# Altium schematic sheet ASBB_SPICrossbar.SchDoc
size A4
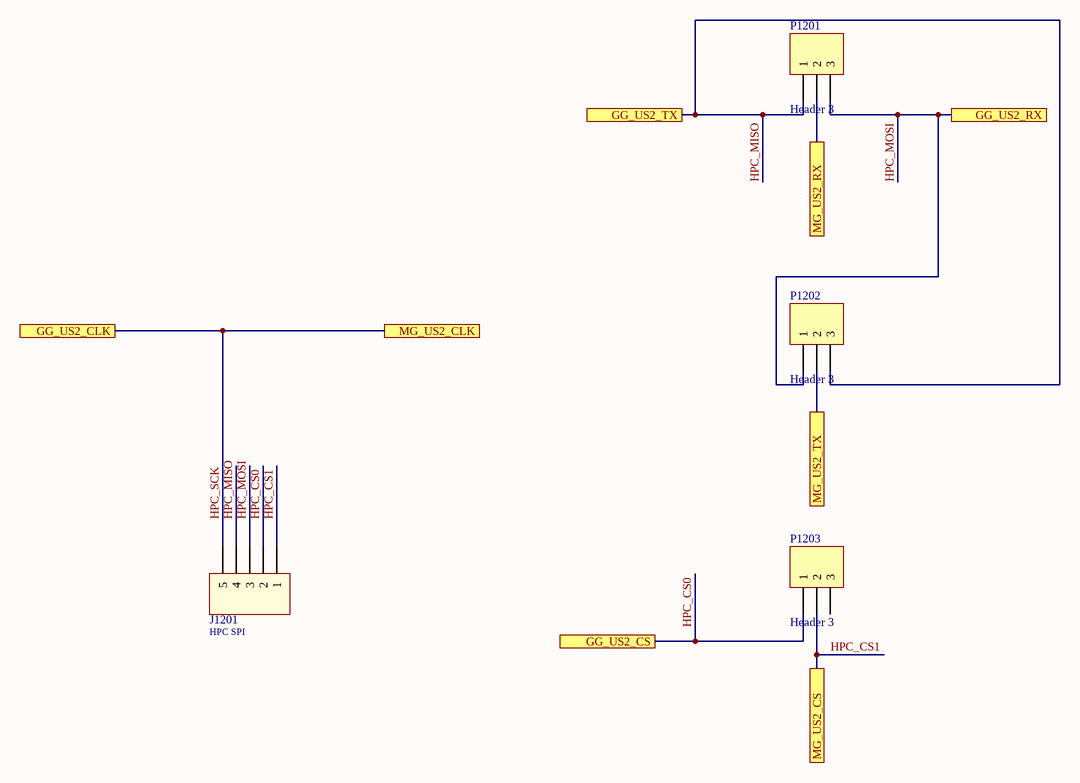
[diagram p0: ASBB_SPICrossbar.SchDoc]

## Parts
J1201  HPC SPI  [61000511921]
P1201  Header 3  [HDR1X3]
P1202  Header 3  [HDR1X3]
P1203  Header 3  [HDR1X3]

## Ports
GG_US2_CLK, GG_US2_CS, GG_US2_RX, GG_US2_TX, MG_US2_CLK, MG_US2_CS, MG_US2_RX, MG_US2_TX

## Nets
HPC_CS0: J1201.2 P1203.1 ; port GG_US2_CS
HPC_CS1: J1201.1 P1203.2 ; port MG_US2_CS
HPC_MISO: J1201.4 P1201.1 P1202.3 ; port GG_US2_TX
HPC_MOSI: J1201.3 P1201.3 P1202.1 ; port GG_US2_RX
HPC_SCK: J1201.5 ; port GG_US2_CLK, port MG_US2_CLK
MG_US2_RX: P1201.2 ; port MG_US2_RX
MG_US2_TX: P1202.2 ; port MG_US2_TX

Not connected (* = marked no-connect by the designer): P1203 3

## Library data of the parts
J1201 = 61000511921: Socket Header WR-PHD, Pitch 2.54 mm, SMT, Vertical, single row, 5 pin; Rated Current: 3 A; Pin Number: 5; Pitch: 2.54 mm; Working Voltage: 250 VAC; Contact Resistance: 20 mOhm; Insulation Resistance: >1000 MOhm; ComponentLink1Description: Manufacturer; ComponentLink1URL: http://www.we-online.de; ComponentLink2Description: Datasheet; ComponentLink2URL: http://katalog.we-online.com/em/datasheet/6100xx11921.pdf; Part Number: 61000511921; Published Date: Jan. 2018; Publisher: Wurth Elektronik; Operating Temperature: -40 to 125 degC; Mounting Technology: SMT; Row Number: single; Orientation: Vertical
P1201-P1203 = Header 3: Header, 3-Pin; LatestRevisionDate: 17-Jul-2002; LatestRevisionNote: Re-released for DXP Platform.; Publisher: Altium Limited